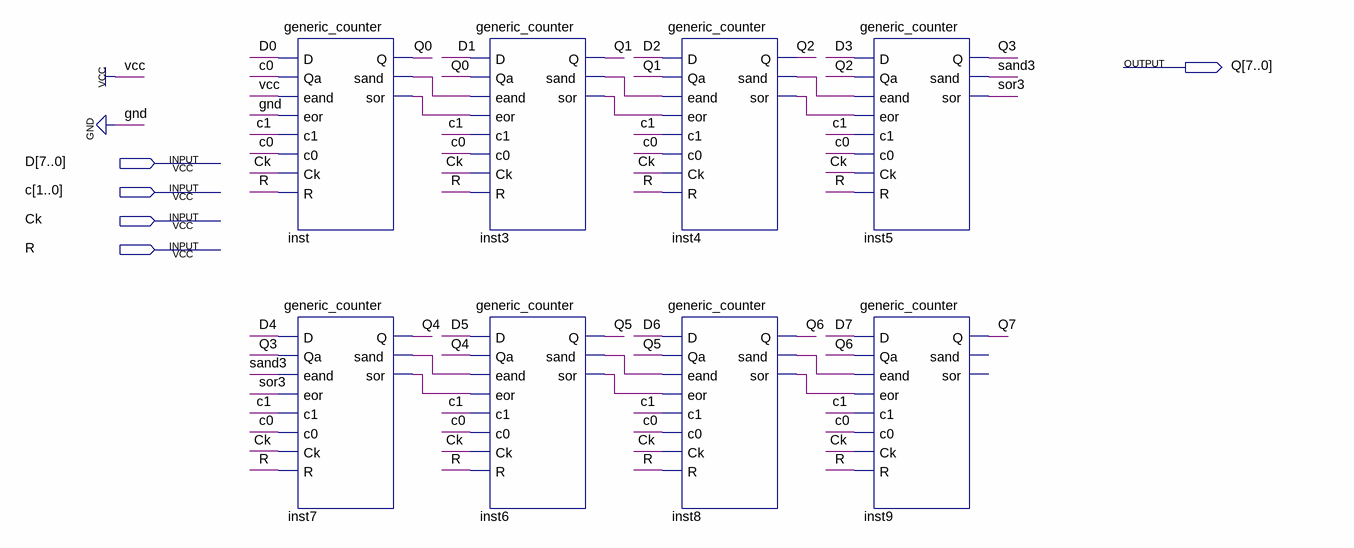
[diagram p0: schematic sheet]
// Quartus schematic counter_8_bits.bdf as structural Verilog: 8 symbols, 5 pins
module counter_8_bits (
  input  [7:0] D,
  input  [1:0] c,
  input  Ck,
  input  R,
  output [7:0] Q
);

  wire inst3_sand, inst3_sor, inst4_sand, inst4_sor, inst6_sand, inst6_sor, inst7_sand, inst7_sor,
       inst8_sand, inst8_sor, inst_sand, inst_sor, sand3, sor3;

  generic_counter inst (
    .D(D[0]), .Qa(c[0]), .eand(1'b1), .eor(1'b0), .c1(c[1]), .c0(c[0]), .Ck(Ck), .R(R), .Q(Q[0]),
    .sand(inst_sand), .sor(inst_sor));
  generic_counter inst7 (
    .D(D[4]), .Qa(Q[3]), .eand(sand3), .eor(sor3), .c1(c[1]), .c0(c[0]), .Ck(Ck), .R(R), .Q(Q[4]),
    .sand(inst7_sand), .sor(inst7_sor));
  generic_counter inst3 (
    .D(D[1]), .Qa(Q[0]), .eand(inst_sand), .eor(inst_sor), .c1(c[1]), .c0(c[0]), .Ck(Ck), .R(R), .Q(Q[1]),
    .sand(inst3_sand), .sor(inst3_sor));
  generic_counter inst6 (
    .D(D[5]), .Qa(Q[4]), .eand(inst7_sand), .eor(inst7_sor), .c1(c[1]), .c0(c[0]), .Ck(Ck), .R(R), .Q(Q[5]),
    .sand(inst6_sand), .sor(inst6_sor));
  generic_counter inst4 (
    .D(D[2]), .Qa(Q[1]), .eand(inst3_sand), .eor(inst3_sor), .c1(c[1]), .c0(c[0]), .Ck(Ck), .R(R), .Q(Q[2]),
    .sand(inst4_sand), .sor(inst4_sor));
  generic_counter inst8 (
    .D(D[6]), .Qa(Q[5]), .eand(inst6_sand), .eor(inst6_sor), .c1(c[1]), .c0(c[0]), .Ck(Ck), .R(R), .Q(Q[6]),
    .sand(inst8_sand), .sor(inst8_sor));
  generic_counter inst5 (
    .D(D[3]), .Qa(Q[2]), .eand(inst4_sand), .eor(inst4_sor), .c1(c[1]), .c0(c[0]), .Ck(Ck), .R(R), .Q(Q[3]),
    .sand(sand3), .sor(sor3));
  generic_counter inst9 (
    .D(D[7]), .Qa(Q[6]), .eand(inst8_sand), .eor(inst8_sor), .c1(c[1]), .c0(c[0]), .Ck(Ck), .R(R), .Q(Q[7]));  // open: sand, sor
endmodule
